# Altium schematic sheet 03_Connector.SchDoc
size A4; SheetNumber: 3; SheetTotal: 3
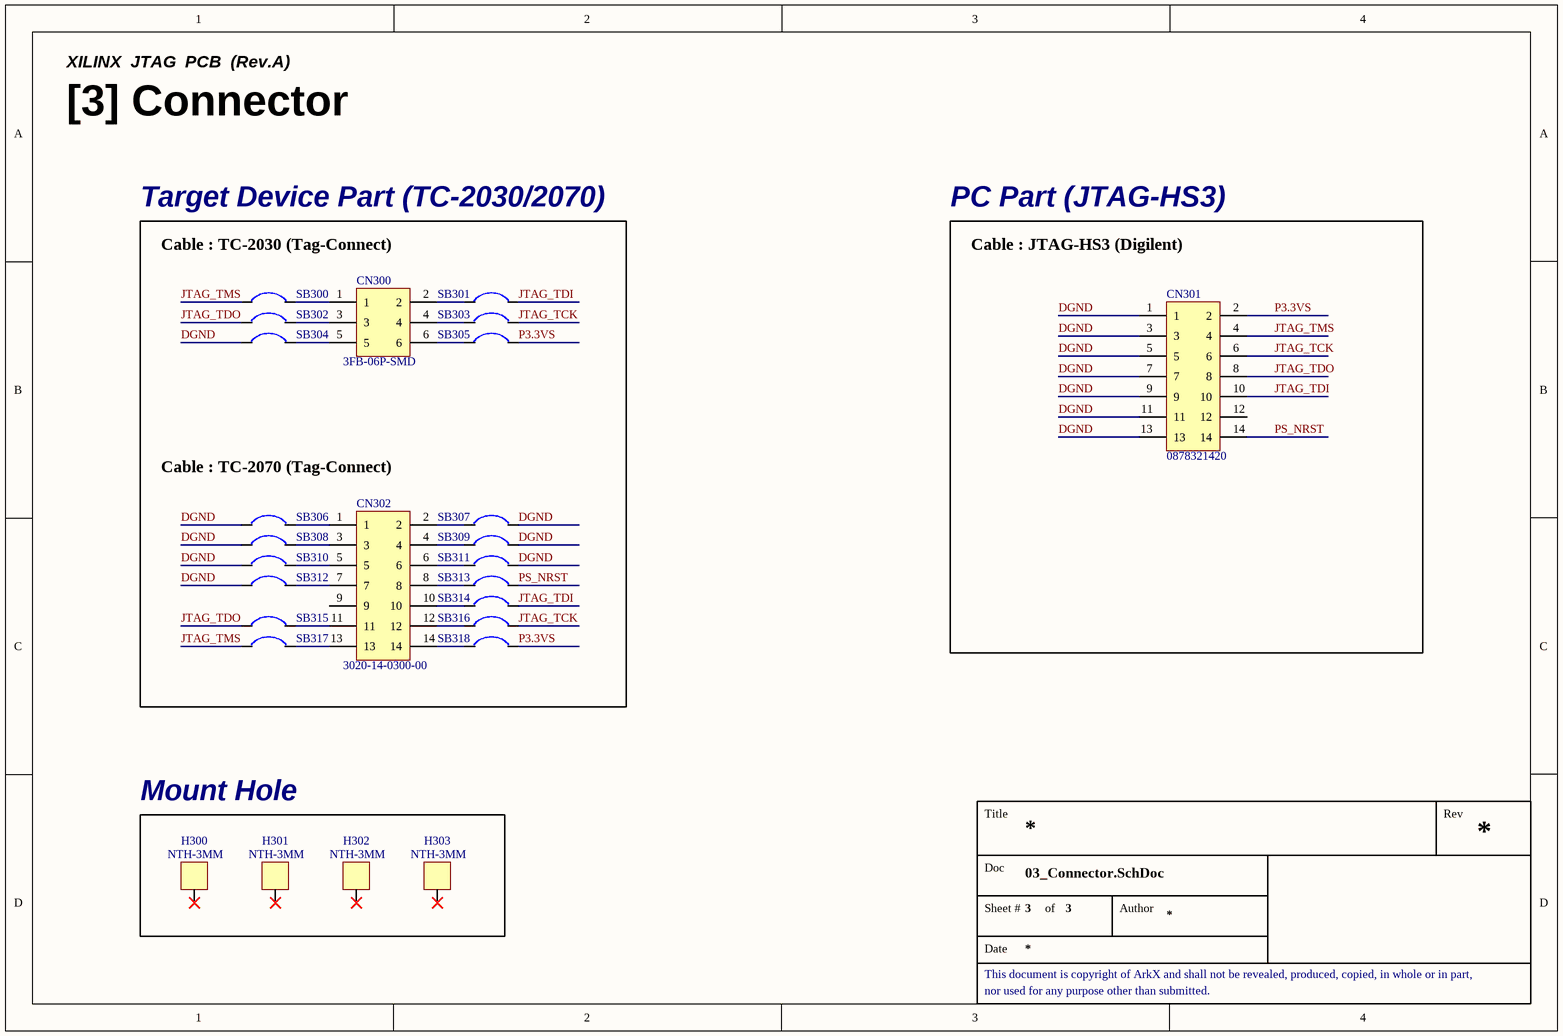
[diagram p0: 03_Connector.SchDoc]

## Parts
CN300  3FB-06P-SMD  [CON_BOX_HEADER_DUAL_2x3PIN(2.54MM)]
CN301  0878321420  [CON_BOX_HEADER_DUAL_2x7PIN(2.00MM) (0878321420)]
CN302  3020-14-0300-00  [CON_BOX_HEADER_DUAL_2x7PIN(2.54MM) (3020-14-0300-00)]
H300  NTH-3MM  [HOLE_NTH-3.0MM]
H301  NTH-3MM  [HOLE_NTH-3.0MM]
H302  NTH-3MM  [HOLE_NTH-3.0MM]
H303  NTH-3MM  [HOLE_NTH-3.0MM]
SB300  SB  [SB_Solder-Bridge (Narrow)]  (value not drawn)
SB301  SB  [SB_Solder-Bridge (Narrow)]  (value not drawn)
SB302  SB  [SB_Solder-Bridge (Narrow)]  (value not drawn)
SB303  SB  [SB_Solder-Bridge (Narrow)]  (value not drawn)
SB304  SB  [SB_Solder-Bridge (Narrow)]  (value not drawn)
SB305  SB  [SB_Solder-Bridge (Narrow)]  (value not drawn)
SB306  SB  [SB_Solder-Bridge (Narrow)]  (value not drawn)
SB307  SB  [SB_Solder-Bridge (Narrow)]  (value not drawn)
SB308  SB  [SB_Solder-Bridge (Narrow)]  (value not drawn)
SB309  SB  [SB_Solder-Bridge (Narrow)]  (value not drawn)
SB310  SB  [SB_Solder-Bridge (Narrow)]  (value not drawn)
SB311  SB  [SB_Solder-Bridge (Narrow)]  (value not drawn)
SB312  SB  [SB_Solder-Bridge (Narrow)]  (value not drawn)
SB313  SB  [SB_Solder-Bridge (Narrow)]  (value not drawn)
SB314  SB  [SB_Solder-Bridge (Narrow)]  (value not drawn)
SB315  SB  [SB_Solder-Bridge (Narrow)]  (value not drawn)
SB316  SB  [SB_Solder-Bridge (Narrow)]  (value not drawn)
SB317  SB  [SB_Solder-Bridge (Narrow)]  (value not drawn)
SB318  SB  [SB_Solder-Bridge (Narrow)]  (value not drawn)

## Blocks framed on the sheet
Target Device Part (TC-2030/2070): CN300 CN302 SB300-SB318
PC Part (JTAG-HS3): CN301
Mount Hole: H300-H303

## Nets
DGND: CN301.1 CN301.3 CN301.5 CN301.7 CN301.9 CN301.11 CN301.13 SB304.1 SB306.1 SB307.2 SB308.1 SB309.2 SB310.1 SB311.2 SB312.1
JTAG_TCK: CN301.6 SB303.2 SB316.2
JTAG_TDI: CN301.10 SB301.2 SB314.2
JTAG_TDO: CN301.8 SB302.1 SB315.1
JTAG_TMS: CN301.4 SB300.1 SB317.1
P3.3VS: CN301.2 SB305.2 SB318.2
PS_NRST: CN301.14 SB313.2
NetCN300_1: CN300.1 SB300.2
NetCN300_2: CN300.2 SB301.1
NetCN300_3: CN300.3 SB302.2
NetCN300_4: CN300.4 SB303.1
NetCN300_5: CN300.5 SB304.2
NetCN300_6: CN300.6 SB305.1
NetCN302_1: CN302.1 SB306.2
NetCN302_2: CN302.2 SB307.1
NetCN302_3: CN302.3 SB308.2
NetCN302_4: CN302.4 SB309.1
NetCN302_5: CN302.5 SB310.2
NetCN302_6: CN302.6 SB311.1
NetCN302_7: CN302.7 SB312.2
NetCN302_8: CN302.8 SB313.1
NetCN302_10: CN302.10 SB314.1
NetCN302_11: CN302.11 SB315.2
NetCN302_12: CN302.12 SB316.1
NetCN302_13: CN302.13 SB317.2
NetCN302_14: CN302.14 SB318.1

Not connected (* = marked no-connect by the designer): CN301 12; CN302 9; H300 1*; H301 1*; H302 1*; H303 1*

## Notes on the sheet
- XILINX  JTAG  PCB  (Rev.A)
- [3] Connector
- Cable : TC-2030 (Tag-Connect)
- Cable : JTAG-HS3 (Digilent)
- Cable : TC-2070 (Tag-Connect)
- Title
- Rev
- Doc
- Sheet #
- of
- Author
- This document is copyright of ArkX and shall not be revealed, produced, copied, in whole or in part,
- Date
- nor used for any purpose other than submitted.

## Library data of the parts
CN300 = CON_BOX_HEADER_DUAL_2x3PIN(2.54MM): BOX HEADER 2x3 Pin SMD / 2.54mm pitch / with IDC Connector
CN301 = CON_BOX_HEADER_DUAL_2x7PIN(2.00MM): CONN HEADER SMD 14POS 2MM
CN302 = CON_BOX_HEADER_DUAL_2x7PIN(2.54MM): BOX HEADER 2x7 Pin SMD / 2.54mm pitch / with IDC Connector
H300-H303 = HOLE_NTH-3.0MM: Non-Through Hole 3mm
SB300-SB318 = SB_Solder-Bridge (Narrow): SB_Solder-Bridge